# Altium schematic sheet BMS.SchDoc: BMS BLOCK
size A4; SheetNumber: 4; SheetTotal: 7; DOC_NO_SCH_DWG: #022024031503
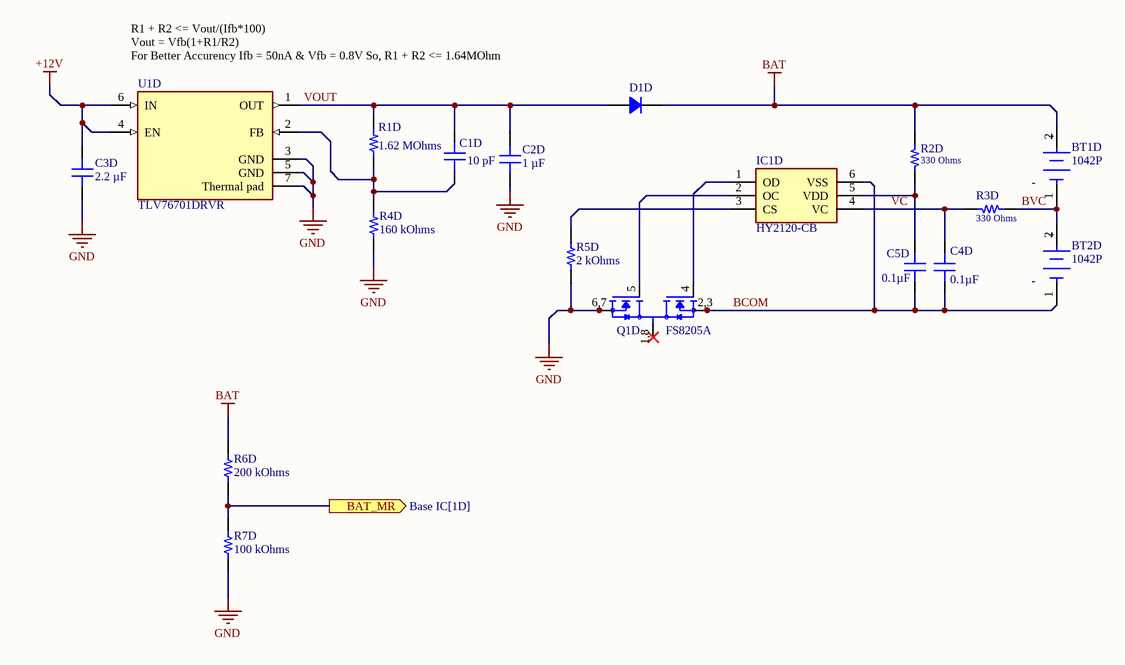
[diagram p0: BMS.SchDoc]

## Parts
BT1D  1042P  [FP-1042P-MFG]
BT2D  1042P  [FP-1042P-MFG]
C1D  10 pF  [CAP 0603_1608]
C2D  1 µF  [CAP 0603_1608]
C3D  2.2 µF  [CAP 0603_1608]
C4D  0.1µF  [CAP 0603_1608]
C5D  0.1µF  [CAP 0603_1608]
D1D  RS1AB-13-F  [DO214AA SMB]  (value not drawn)
IC1D  HY2120-CB  [SOT95P280X140-6N]
Q1D  FS8205A  [SOP65P640X120-8N]
R1D  1.62 MOhms  [RES 0603_1608]
R2D  330 Ohms  [RES 0603_1608]
R3D  330 Ohms  [RES 0603_1608]
R4D  160 kOhms  [RES 0603_1608]
R5D  2 kOhms  [RES 0603_1608]
R6D  200 kOhms  [RES 1206_3216]
R7D  100 kOhms  [RES 1206_3216]
U1D  TLV76701DRVR  [FP-DRV0006A-IPC_C]

## Ports
BAT_MR (out, see Base IC[1D])

## Nets
+12V: C3D.2 U1D.4(EN) U1D.6(IN)
BAT: BT1D.2(A) D1D.2 R2D.1 R6D.2
GND: C2D.1 C3D.1 Q1D.6(S2) Q1D.6,7(S2) R4D.1 R5D.1 R7D.1 U1D.3(GND) U1D.5(GND) U1D.7(Thermal_pad)
BAT_MR: R6D.1 R7D.2 ; port BAT_MR
BCOM: BT2D.1(C) C4D.1 C5D.1 IC1D.6(VSS) Q1D.2(S1) Q1D.2,3(S1)
BVC: BT1D.1(C) BT2D.2(A) R3D.1
VC: C4D.2 IC1D.4(VC) R3D.2
VOUT: C1D.2 C2D.2 D1D.1 R1D.2 U1D.1(OUT)
NetC1D_1: C1D.1 R1D.1 R4D.2 U1D.2(FB)
NetC5D_2: C5D.2 IC1D.5(VDD) R2D.2
NetIC1D_1: IC1D.1(OD) Q1D.4(G1)
NetIC1D_2: IC1D.2(OC) Q1D.5(G2)
NetIC1D_3: IC1D.3(CS) R5D.2
NetQ1D_1: Q1D.1(D12) Q1D.1,8(D12)

## Notes on the sheet
- (near U1D) R1 + R2 <= Vout/(Ifb*100)
  Vout = Vfb(1+R1/R2)
  For Better Accurency Ifb = 50nA & Vfb = 0.8V So, R1 + R2 <= 1.64MOhm
- THIS DOCUMENT AND THE DATA DISCLOSED HEREIN OR
- HEREWITH IS THE PROPERTY OF SPD Ind.
- ENG:
- DHARAGESWARAN S
- APPROVALS
- DATE
- PROJECT
- DSN:
- CHK:
- REFERENCE DOCUMENTS
- PROJECT REVISION:
- TITLE
- DOCUMENT REVISION:
- Email: sdhamuvkl@gmail.com <https://github.com/DhamuVkl>
- BOM:
- FAB DWG:
- PCB DWG:
- ASSY DWG:
- SCALE:
- A4
- SIZE
- CAGE CODE
- FILE NAME
- DWG NO.
- SHEET
- REV
- OF
- (in symbol CMP-19636-000019-1) +; -

## Library data of the parts
BT1D BT2D = CMP-19636-000019-1: BATTERY HOLDER 18650 SMD TAB; Number of Cells: 1; Max Operating Temperature: 145°C; Termination: SMD/SMT; Mount: Surface Mount; Min Operating Temperature: -50°C; Package Quantity: 200; Packaging: Tray; Lead Free: Lead Free
C1D = 885012006017: CAP CER 10PF 16V C0G/NP0 0603; Manufacturer: Würth Elektronik; id: 4142; Temperature Coefficient: C0G, NP0; Tolerance: ±5%; Part Number: 885012006017; Value: 10 pF; Supplier Part Number 1: 732-7760-1-ND; ComponentLink2Description: DigiKey Link; ComponentLink1URL: https://katalog.we-online.de/pbs/datasheet/885012006017.pdf; PartId: 17575; Supplier 1: DigiKey; Series: WCAP-CSGP; LastUpdated: 2023-01-03T20:07:00.397; Part Status: Active; Capacitance: 10 pF; Device Package: 0603 (1608 Metric); Thickness (Max): 0.034" (0.87mm); Voltage - Rated: 16V; Minimum Order: 1; Packaging: TapeAndReel; Applications: General Purpose; Package / Case: 0603 (1608 Metric); ComponentLink1Description: Datasheet; Price: 0.02; ComponentLink2URL: https://www.digikey.com/en/products/detail/würth-elektronik/885012006017/5453615; Lifecycle Status: Active; Operating Temperature: -55°C ~ 125°C; Size / Dimension: 0.063" L x 0.031" W (1.60mm x 0.80mm); Mounting Type: Surface Mount, MLCC
C2D = CC0603ZRY5V7BB105: CAP CER 1UF 16V Y5V 0603; Manufacturer: Yageo; id: 744; Temperature Coefficient: Y5V (F); Tolerance: -20%, +80%; Part Number: CC0603ZRY5V7BB105; Value: 1 µF; Supplier Part Number 1: 311-1372-1-ND; ComponentLink2Description: DigiKey Link; ComponentLink1URL: http://www.yageo.com/documents/recent/UPY-GPHC_Y5V_6.3V-to-50V_8.pdf; PartId: 5227; Supplier 1: DigiKey; Series: CC; LastUpdated: 2023-01-03T20:07:40.173; Part Status: Active; Capacitance: 1 µF; Device Package: 0603 (1608 Metric); Thickness (Max): 0.035" (0.90mm); Voltage - Rated: 16V; Minimum Order: 1; Packaging: TapeAndReel; Applications: General Purpose; Package / Case: 0603 (1608 Metric); ComponentLink1Description: Datasheet; Price: 0.01; ComponentLink2URL: https://www.digikey.com/en/products/detail/yageo/CC0603ZRY5V7BB105/2103110; Lifecycle Status: Active; Operating Temperature: -30°C ~ 85°C; Size / Dimension: 0.063" L x 0.031" W (1.60mm x 0.80mm); Mounting Type: Surface Mount, MLCC
C3D = CC0603ZRY5V7BB225: CAP CER 2.2UF 16V Y5V 0603; Manufacturer: Yageo; id: 21; Temperature Coefficient: Y5V (F); Tolerance: -20%, +80%; Part Number: CC0603ZRY5V7BB225; Value: 2.2 µF; Supplier Part Number 1: 311-3416-1-ND; ComponentLink2Description: DigiKey Link; ComponentLink1URL: http://www.yageo.com/documents/recent/UPY-GPHC_Y5V_6.3V-to-50V_8.pdf; PartId: 2203; Supplier 1: DigiKey; Series: CC; LastUpdated: 2023-01-03T20:07:48.310; Part Status: Active; Capacitance: 2.2 µF; Device Package: 0603 (1608 Metric); Thickness (Max): 0.035" (0.90mm); Voltage - Rated: 16V; Minimum Order: 1; Packaging: TapeAndReel; Applications: General Purpose; Package / Case: 0603 (1608 Metric); ComponentLink1Description: Datasheet; Price: 0.01; ComponentLink2URL: https://www.digikey.com/en/products/detail/yageo/CC0603ZRY5V7BB225/5883851; Lifecycle Status: Active; Operating Temperature: -30°C ~ 85°C; Size / Dimension: 0.063" L x 0.031" W (1.60mm x 0.80mm); Mounting Type: Surface Mount, MLCC
C4D C5D = LD03YC104JAB2A: CAP CER 0.1UF 16V X7R 0603; Manufacturer: AVX Corporation; id: 1923; Tolerance: ±5%; Part Number: LD03YC104JAB2A; Value: 0.1µF; Temperature Coefficient: X7R; Supplier Part Number 1: 478-4928-1-ND; ComponentLink2Description: DigiKey Link; ComponentLink1URL: http://datasheets.avx.com/LD-Series.pdf; PartId: 10388; Supplier 1: DigiKey; Series: LD; LastUpdated: 2020-09-02T01:03:21.410; Part Status: Active; Capacitance: 0.1µF; Device Package: 0603 (1608 Metric); Thickness (Max): 0.035" (0.90mm); Voltage - Rated: 16V; Minimum Order: 1; Packaging: TapeAndReel; Applications: General Purpose; Package / Case: 0603 (1608 Metric); ComponentLink1Description: Datasheet; Price: 0.19; ComponentLink2URL: http://digikey.com/product-detail/en/avx-corporation/LD03YC104JAB2A/478-4928-1-ND/1858874; Lifecycle Status: Active; Operating Temperature: -55°C ~ 125°C; Size / Dimension: 0.063" L x 0.032" W (1.60mm x 0.81mm); Mounting Type: Surface Mount, MLCC
D1D = RS1AB-13-F: DIODE GEN PURP 50V 1A SMB; Manufacturer: Diodes Incorporated; id: 27; Reverse Recovery Time (Trr): 150 ns; Capacitance @ Vr, F: 15pF @ 4V, 1MHz; Speed: Fast Recovery =< 500ns, > 200mA (Io); Voltage - Forward (Vf) (Max) @ If: 1.3 V @ 1 A; Diode Type: Standard; Current - Reverse Leakage @ Vr: 5 µA @ 50 V; Part Number: RS1AB-13-F; Supplier Part Number 1: RS1AB-FDICT-ND; Supplier Device Package: SMB; ComponentLink1Description: Datasheet; ComponentLink2URL: https://www.digikey.com/en/products/detail/diodes-incorporated/RS1AB-13-F/814456; ComponentLink1URL: https://www.diodes.com/assets/Datasheets/ds15002.pdf; Supplier 1: DigiKey; Series: -; Part Status: Active; ComponentLink2Description: DigiKey Link; Current - Average Rectified (Io): 1A; Operating Temperature - Junction: -65°C ~ 150°C; Packaging: TapeAndReel; Minimum Order: 1; Voltage - DC Reverse (Vr) (Max): 50 V; Package / Case: DO-214AA, SMB; PartId: 27; Lifecycle Status: Active; LastUpdated: 2023-01-02T20:53:12.200; Mounting Type: Surface Mount; Price: 0.07
IC1D = HY2120-CB: BMS; Manufacturer_Name: Hycon; Datasheet Link: https://datasheet.lcsc.com/szlcsc/HYCON-Tech-HY2120CB_C116509.pdf; Height: 1.4mm; Manufacturer_Part_Number: HY2120-CB
Q1D = FS8205A: N/A; MF: Fortune Semiconductor; MP: FS8205A; Value: *; Availability: Not in stock; Package: Package; Price: None; SnapEDA_Link: https://www.snapeda.com/parts/FS8205A/Fortune+Semiconductor/view-part/?ref=snap; Check_prices: https://www.snapeda.com/parts/FS8205A/Fortune+Semiconductor/view-part/?ref=eda
R1D = RMCF0603FT1M62: RES 1.62M OHM 1% 1/10W 0603; Manufacturer: Stackpole Electronics Inc; id: 12536; Temperature Coefficient: ±200ppm/°C; Power (Watts): 0.1W, 1/10W; Part Number: RMCF0603FT1M62; Height - Seated (Max): 0.022" (0.55mm); Supplier Part Number 1: RMCF0603FT1M62CT-ND; Supplier Device Package: 0603; ComponentLink1Description: Datasheet; ComponentLink2URL: https://www.digikey.com/en/products/detail/stackpole-electronics-inc/RMCF0603FT1M62/1713506; Features: Automotive AEC-Q200; ComponentLink1URL: https://www.seielect.com/catalog/sei-rmcf_rmcp.pdf; Composition: Thick Film; Tolerance: ±1%; Supplier 1: DigiKey; Series: RMCF; Part Status: Active; ComponentLink2Description: DigiKey Link; Device Package: 0603 (1608 Metric); Packaging: CutTape; Ratings: AEC-Q200; Minimum Order: 1; Package / Case: 0603 (1608 Metric); PartId: 26334; Lifecycle Status: Active; LastUpdated: 2023-01-02T20:28:35.533; Operating Temperature: -55°C ~ 155°C; Number Of Terminations: 2; Value: 1.62 MOhms; Size / Dimension: 0.061" L x 0.031" W (1.55mm x 0.80mm); Price: 0.01; Resistance: 1.62 MOhms
R2D R3D = CRCW0603330RFKEAC: RES 330 OHM 1% 1/10W 0603; Manufacturer: Vishay Dale; id: 3752; Temperature Coefficient: ±100ppm/°C; Power (Watts): 0.1W, 1/10W; Part Number: CRCW0603330RFKEAC; Height - Seated (Max): 0.022" (0.55mm); Supplier Part Number 1: 541-4026-1-ND; Supplier Device Package: 0603; ComponentLink1Description: Datasheet; ComponentLink2URL: https://www.digikey.com/en/products/detail/vishay-dale/CRCW0603330RFKEAC/7928448; ComponentLink1URL: http://www.vishay.com/docs/28773/crcwce3.pdf; Composition: Thick Film; Tolerance: ±1%; Supplier 1: DigiKey; Series: CRCW-C; Part Status: Active; ComponentLink2Description: DigiKey Link; Device Package: 0603 (1608 Metric); Packaging: CutTape; Minimum Order: 1; Package / Case: 0603 (1608 Metric); PartId: 12584; Lifecycle Status: Active; LastUpdated: 2023-01-02T20:29:55.413; Operating Temperature: -55°C ~ 155°C; Number Of Terminations: 2; Value: 330 Ohms; Price: 0.01; Resistance: 330 Ohms
R4D = RMCF0603FG160K: RES 160K OHM 1% 1/10W 0603; Manufacturer: Stackpole Electronics Inc; id: 2352; Temperature Coefficient: ±100ppm/°C; Power (Watts): 0.1W, 1/10W; Part Number: RMCF0603FG160K; Height - Seated (Max): 0.022" (0.55mm); Supplier Part Number 1: 738-RMCF0603FG160KCT-ND; Supplier Device Package: 0603; ComponentLink1Description: Datasheet; ComponentLink2URL: https://www.digikey.com/en/products/detail/stackpole-electronics-inc/RMCF0603FG160K/1713653; Features: Automotive AEC-Q200; ComponentLink1URL: https://www.seielect.com/catalog/sei-rmcf_rmcp.pdf; Composition: Thick Film; Tolerance: ±1%; Supplier 1: DigiKey; Series: RMCF; Part Status: Active; ComponentLink2Description: DigiKey Link; Device Package: 0603 (1608 Metric); Packaging: CutTape; Ratings: AEC-Q200; Minimum Order: 1; Package / Case: 0603 (1608 Metric); PartId: 9704; Lifecycle Status: Active; LastUpdated: 2023-01-02T20:30:07.700; Operating Temperature: -55°C ~ 155°C; Number Of Terminations: 2; Value: 160 kOhms; Size / Dimension: 0.061" L x 0.031" W (1.55mm x 0.80mm); Price: 0.01; Resistance: 160 kOhms
R5D = RT0603BRD072KL: RES SMD 2K OHM 0.1% 1/10W 0603; Manufacturer: Yageo; id: 366; Temperature Coefficient: ±25ppm/°C; Power (Watts): 0.1W, 1/10W; Part Number: RT0603BRD072KL; Height - Seated (Max): 0.022" (0.55mm); Supplier Part Number 1: YAG1626CT-ND; Supplier Device Package: 0603; ComponentLink1Description: Datasheet; ComponentLink2URL: https://www.digikey.com/en/products/detail/yageo/RT0603BRD072KL/1072444; ComponentLink1URL: https://www.yageo.com/upload/media/product/productsearch/datasheet/rchip/PYu-RT_1-to-0.01_RoHS_L_11.pdf; Composition: Thin Film; Tolerance: ±0.1%; Supplier 1: DigiKey; Series: RT; Part Status: Active; ComponentLink2Description: DigiKey Link; Device Package: 0603 (1608 Metric); Packaging: TapeAndReel; Minimum Order: 1; Package / Case: 0603 (1608 Metric); PartId: 5635; Lifecycle Status: Active; LastUpdated: 2023-01-02T20:30:23.983; Operating Temperature: -55°C ~ 155°C; Number Of Terminations: 2; Value: 2 kOhms; Size / Dimension: 0.063" L x 0.031" W (1.60mm x 0.80mm); Price: 0.03; Resistance: 2 kOhms
R6D = ERA-8AEB204V: RES SMD 200K OHM 0.1% 1/4W 1206; Manufacturer: Panasonic Electronic Components; id: 4000; Temperature Coefficient: ±25ppm/°C; Power (Watts): 0.25W, 1/4W; Part Number: ERA-8AEB204V; Height - Seated (Max): 0.028" (0.70mm); Supplier Part Number 1: P200KBCCT-ND; Supplier Device Package: 1206; ComponentLink1Description: Datasheet; ComponentLink2URL: https://www.digikey.com/en/products/detail/panasonic-electronic-components/ERA-8AEB204V/3070868; Features: Automotive AEC-Q200; ComponentLink1URL: https://industrial.panasonic.com/cdbs/www-data/pdf/RDM0000/AOA0000C307.pdf; Composition: Thin Film; Tolerance: ±0.1%; Supplier 1: DigiKey; Series: ERA-8A; Part Status: Active; ComponentLink2Description: DigiKey Link; Device Package: 1206 (3216 Metric); Packaging: TapeAndReel; Ratings: AEC-Q200; Minimum Order: 1; Package / Case: 1206 (3216 Metric); PartId: 33994; Lifecycle Status: Active; LastUpdated: 2023-01-02T20:37:01.767; Operating Temperature: -55°C ~ 155°C; Number Of Terminations: 2; Value: 200 kOhms; Size / Dimension: 0.126" L x 0.063" W (3.20mm x 1.60mm); Price: 0.12; Resistance: 200 kOhms
R7D = RT1206BRD07100KL: RES SMD 100K OHM 0.1% 1/4W 1206; Manufacturer: Yageo; id: 6936; Temperature Coefficient: ±25ppm/°C; Power (Watts): 0.25W, 1/4W; Part Number: RT1206BRD07100KL; Height - Seated (Max): 0.026" (0.65mm); Supplier Part Number 1: YAG2003CT-ND; Supplier Device Package: 1206; ComponentLink1Description: Datasheet; ComponentLink2URL: https://www.digikey.com/en/products/detail/yageo/RT1206BRD07100KL/1079461; ComponentLink1URL: https://www.yageo.com/upload/media/product/productsearch/datasheet/rchip/PYu-RT_1-to-0.01_RoHS_L_11.pdf; Composition: Thin Film; Tolerance: ±0.1%; Supplier 1: DigiKey; Series: RT; Part Status: Active; ComponentLink2Description: DigiKey Link; Device Package: 1206 (3216 Metric); Packaging: TapeAndReel; Minimum Order: 1; Package / Case: 1206 (3216 Metric); PartId: 39875; Lifecycle Status: Active; LastUpdated: 2023-01-02T20:36:33.687; Operating Temperature: -55°C ~ 155°C; Number Of Terminations: 2; Value: 100 kOhms; Size / Dimension: 0.122" L x 0.063" W (3.10mm x 1.60mm); Price: 0.10; Resistance: 100 kOhms
U1D = CMP-04917-000172-1: IC REG LINEAR POS ADJ 1A 6WSON